# EAGLE design SOT223-SOT89 (EAGLE 7.3.0)
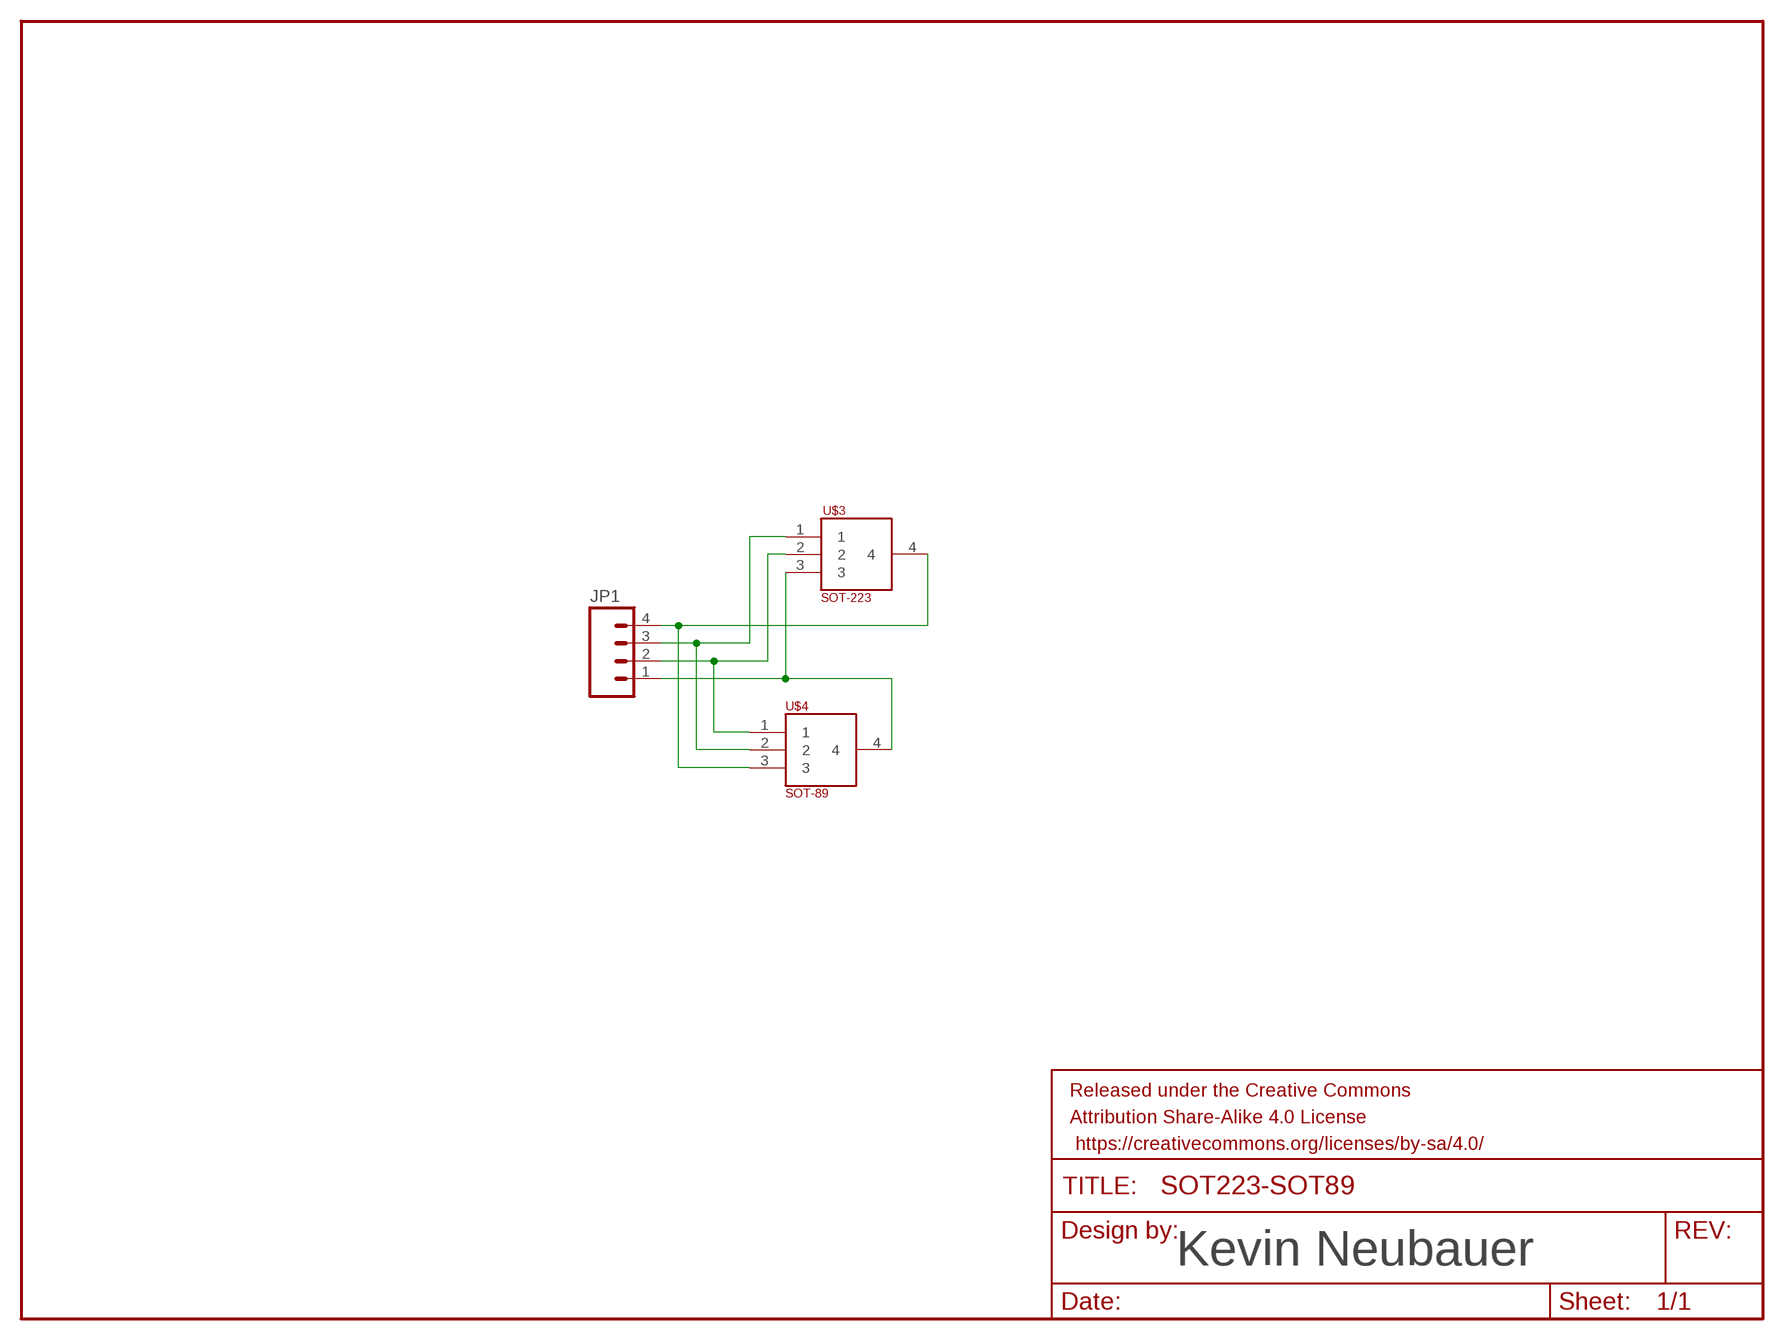
[diagram p0: schematic, sheet 1]

## Parts
FRAME1  FRAME-LETTER  [CREATIVE_COMMONS]
JP1  M04PTH  [1X04]
U$3  SOT-223  [SOT-223]
U$4  SOT-89  [SOT-89]

## Nets
N$2: JP1.2 U$3.2 U$4.1
N$3: JP1.3 U$3.1 U$4.2
N$4: JP1.1 U$3.3 U$4.4
N$5: JP1.4 U$3.4 U$4.3

## Notes on the sheet
- Kevin Neubauer

## Library data of the parts
FRAME1 = SparkFun-Aesthetics:FRAME-LETTER: Schematic Frame Standard 8.5x11 US Letter frame
JP1 = SparkFun-Connectors:M04: Header 4 Standard 4-pin 0.1" header. Use with straight break away headers (SKU : PRT-00116), right angle break away headers (PRT-00553), swiss pins (PRT-00743), machine pins (PRT-00117), and female headers (PRT-00115). Molex polarized connector foot print use with SKU : PRT-08231 with associated crimp pins and housings. 1MM SMD Version SKU: PRT-10208
U$3 = Kevin-GenericICFootprints:SOT-223
U$4 = Kevin-GenericICFootprints:SOT-89

## Board
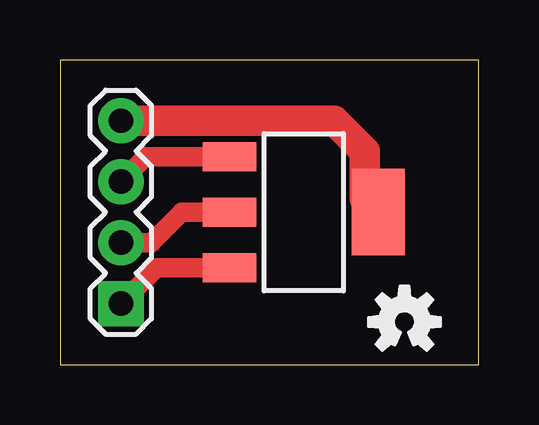
[diagram p1: board, top side]
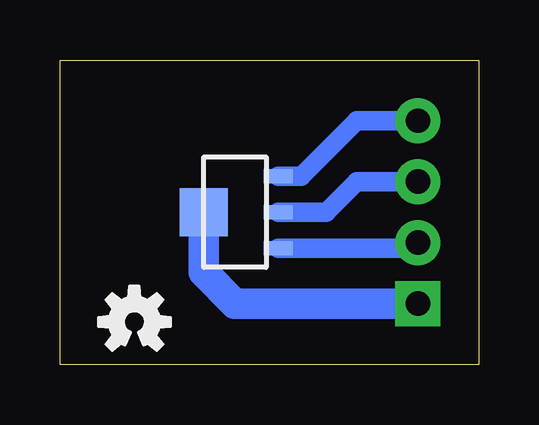
[diagram p2: board, bottom side, seen from below]

Size 17.45 x 12.69 mm. Coordinates in mm from the lower left corner, seen from the top.
Outline: 0,0 17.45,0 17.45,12.69 0,12.69 0,0
Copper layers (1*16): Top 0.0356mm / dielectric 1.5011mm / Bottom 0.0356mm
Design rules "OSH Park": minimum track width 6mil, minimum drill 13mil, track to track 6mil, track to pad 6mil, pad to pad 6mil, via to via 6mil, smd to smd 6mil, copper to edge 15mil, drill to drill 6mil, minimum pad ring 7mil, minimum via ring 7mil, stop-mask expansion 3mil, vias tented up to drill 0mil, thermal gap 10mil

### Footprints (pad centres in the part's own frame; a part is rotated, then mirrored left to right if it is on the bottom)
1X04 = drill 1.016 pad 1.88 square: 1 0,0 | drill 1.016 pad 1.88: 2 2.54,0; 3 5.08,0; 4 7.62,0
SOT-223 = smd 1.219 x 2.235: 1 -2.311,-3.099; 2 0,-3.099; 3 2.311,-3.099 | smd 3.6 x 2.2: 4 0,3.099
SOT-89 = smd 0.58 x 1.2: 1 -1.5,-1.8; 2 0,-1.8; 3 1.5,-1.8 | smd 2 x 2: 4 0,1.3

### Placement (x,y rotation side)
FRAME1  -6.1,-9.14 0 top  (outside the outline)
JP1  2.54,2.54 90 top
U$1  [OSHW-LOGO-S]  14.35,1.78 0 top
U$2  [OSHW-LOGO-S]  14.35,1.78 0 bottom
U$3  10.16,6.35 270 top
U$4  10.16,6.35 90 bottom

### Tracks (layer width: path | path; a pad name or v marks a point on that pad's centre or on a via)
N$2
  Top 0.813: JP1.2 3.81,5.08 5.08,6.35 U$3.2
  Bottom 0.813: U$4.1 2.77,4.85 JP1.2
N$3
  Top 0.813: U$3.1 3.58,8.66 JP1.3
  Bottom 0.813: U$4.2 6.35,6.35 5.08,7.62 JP1.3
N$4
  Top 0.813: U$3.3 4.04,4.04 JP1.1
  Bottom 1.27: U$4.4 11.46,3.84 10.16,2.54 JP1.1
N$5
  Top 0.813: 12.7,6.91 U$3.4
  Top 1.27: 12.7,6.91 12.7,8.89 11.43,10.16 JP1.4
  Bottom 0.813: U$4.3 7.39,7.85 5.08,10.16 JP1.4

### Text on the board
tDocu: Kevin Neubauer